# Altium schematic sheet Controller.SchDoc
size A4; SheetNumber: 1; SheetTotal: 7
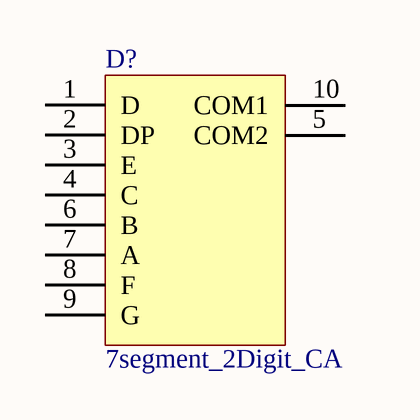
[diagram p0: Controller.SchDoc]

## Parts
D?  7segment_2Digit_CA  [7segment_2Digit_CA]

## Nets

Not connected (* = marked no-connect by the designer): D? 1(D) 2(DP) 3(E) 4(C) 5(COM2) 6(B) 7(A) 8(F) 9(G) 10(COM1)

## Library data of the parts
D? = 7segment_2Digit_CA: 7segment_2Digit_CA (4021BS) 20.1 * 16